# Altium schematic sheet TD.0002-100_3.SchDoc: ДТТ-1
size 420 x 297 mm; ApprovedBy: Маханов; CheckedBy: Айкеева; Organization: РЭТ-41; SheetNumber: 3; SheetTotal: 3; ProcessInspection: Айкеева; NormInspection: Мухамедрахимова
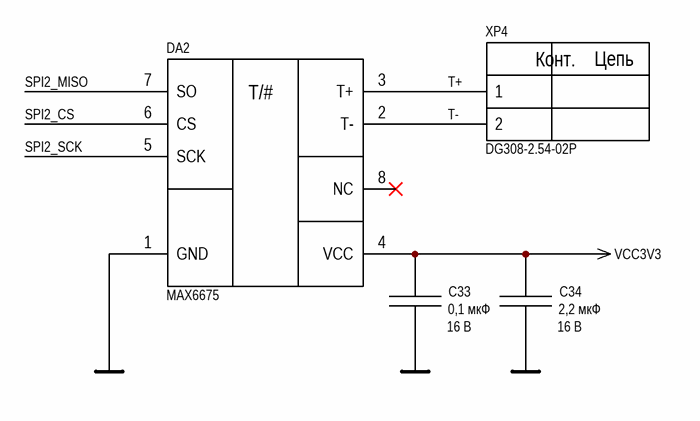
[diagram p0: TD.0002-100_3.SchDoc]

## Parts
C33  value 0,1 мкФ  Voltage: 16 В  [C_0402]  (hidden comment: GRM155R61C104KA88)
C34  value 2,2 мкФ  Voltage: 16 В  [C_0402]  (hidden comment: GRM155R61C225KE11)
DA2  MAX6675  [SOIC-8]
XP4  DG308-2.54-02P  [Terminal_Block_2PIN]

## Nets
GND: C33.2 C34.2 DA2.1(GND)
VCC3V3: C33.1 C34.1 DA2.4(VCC)
SPI2_CS: DA2.6(CS)
SPI2_MISO: DA2.7(SO)
SPI2_SCK: DA2.5(SCK)
T+: DA2.3(T+) XP4.1
T-: DA2.2(T-) XP4.2

Not connected (* = marked no-connect by the designer): DA2 8(NC)*

## Notes on the sheet
- (near DA2) T/#
- Перв. примен.
- Справ. №
- Подп. и дата
- Инв. № дубл.
- Взам. инв. №
- Изм.
- Лист
- № докум.
- Подп.
- Дата
- Лит.
- Масса
- Масштаб
- Т.контр.
- Пров.
- Разраб.
- Листов
- Инв. № подл.
- Н.контр.
- Утв.
- Копировал
- Формат А3
- (in symbol DG308-2.54-02P-14-00AH) Конт.; Цепь

## Library data of the parts
C33 = GRM155R61C104KA88: Chip Multilayer Ceramic Capacitor; Manufacturer: Murata; TC: X5R; Tolerance: ±10%; Type: Конденсатор керамический; Operating temperature: -55 … 85 °C; Part Number: GRM155R61C104KA88; Library Ref: *; Library Path: *; Package: SMD 0402; Temperature coefficient: *
C34 = GRM155R61C225KE11: Chip Multilayer Ceramic Capacitor; Manufacturer: Murata; TC: X5R; Tolerance: ±10%; Type: Конденсатор керамический; Operating temperature: -55 … 85 °C; Part Number: GRM155R61C225KE11; Library Ref: *; Library Path: *; Package: SMD 0402; Temperature coefficient: *
DA2 = MAX6675: Manufacturer: Maxim Integrated; Measuring range: 0 ... +600/(+1024) ºC; Supply Voltage: -0,3 ... 6 V; SO Current: 50 mA; Type: Thermocouple to Digital Converter; Operating temperature range: -20 ... +85 ºC
XP4 = DG308-2.54-02P-14-00AH: Manufacturer: Dinkle; Voltage: 250 V; Current: 8 A; Contact step: 2.54 mm; Type: Terminal Block; Operating temperature: -30 … 120 ºC